# EAGLE design progUSB (EAGLE 5.10)
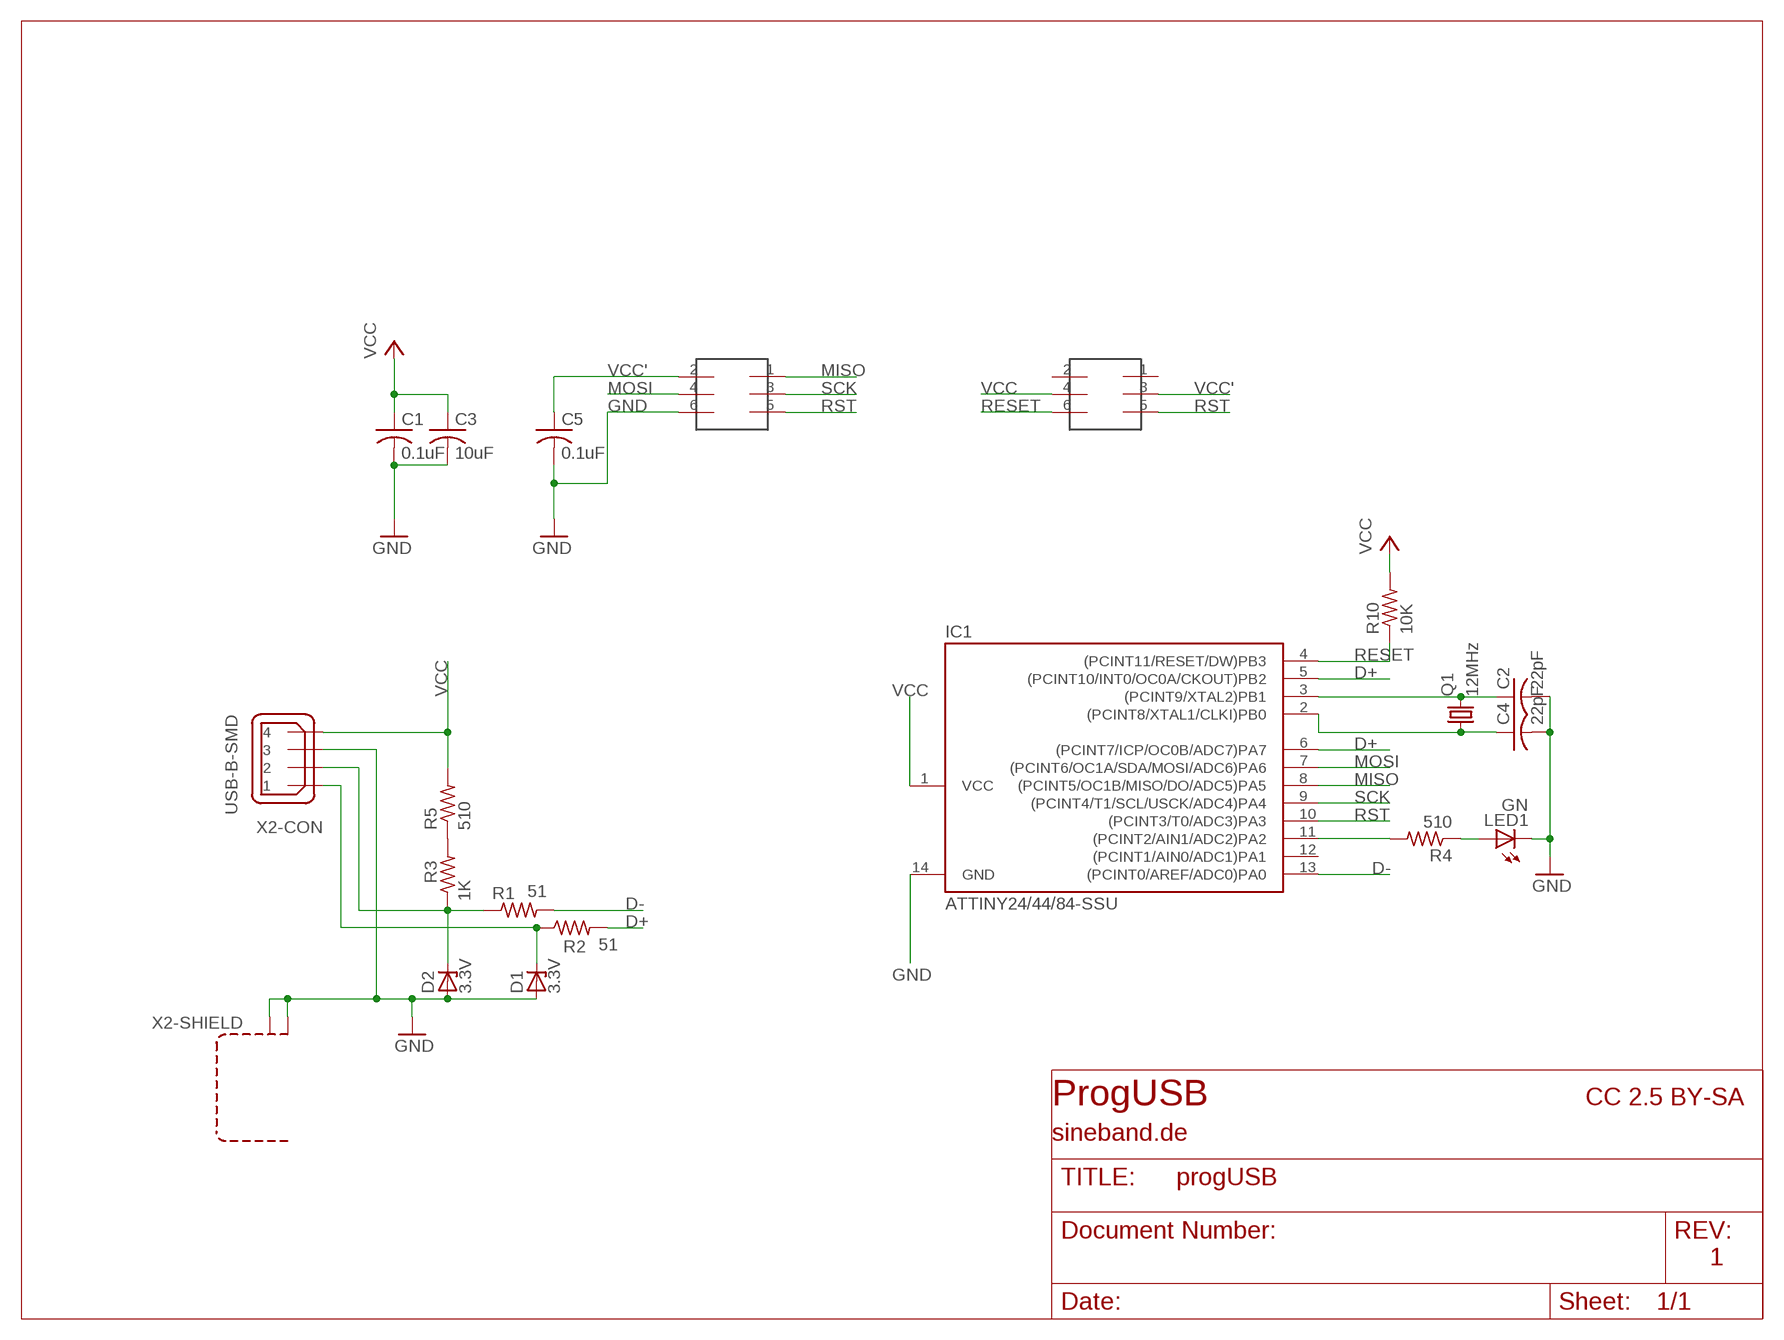
[diagram p0: schematic, sheet 1]

## Parts
C1  0.1uF  C-USC1206  [C1206]
C2  22pF  C-USC1206  [C1206]
C3  10uF  C-USC1206  [C1206]
C4  22pF  C-USC1206  [C1206]
C5  0.1uF  C-USC1206  [C1206]
D1  3.3V  ZENER-DIODESOT23  [SOT23]
D2  3.3V  ZENER-DIODESOT23  [SOT23]
IC1  ATTINY24/44/84-SSU  [SOIC14]
LED1  GN  LEDCHIPLED_0805  [CHIPLED_0805]
Q1  12MHz  CRYSTALHC49UP  [HC49UP]
R1  51  R-US_R1206  [R1206]
R2  51  R-US_R1206  [R1206]
R3  1K  R-US_R1206  [R1206]
R4  510  R-US_R1206  [R1206]
R5  510  R-US_R1206  [R1206]
R10  10K  R-US_R1206  [R1206]
U$1  2X3HEADER  [2X3_SMD]
U$2  2X3HEADER  [2X3_SMD]
X2  USB-B-SMD  [USB-B-SMD]

## Nets
D+: IC1.5((PCINT10/INT0/OC0A/CKOUT)PB2) IC1.6((PCINT7/ICP/OC0B/ADC7)PA7) R2.2
D-: IC1.13((PCINT0/AREF/ADC0)PA0) R1.2
GND: C1.2 C2.2 C3.2 C4.2 C5.2 D1.1(A) D2.1(A) IC1.14(GND) LED1.C U$1.6 X2.3 X2.M1(-SHIELD:S1) X2.M2(-SHIELD:S2)
MISO: IC1.8((PCINT5/OC1B/MISO/DO/ADC5)PA5) U$1.1
MOSI: IC1.7((PCINT6/OC1A/SDA/MOSI/ADC6)PA6) U$1.4
N$1: D2.3(C) R1.1 R3.1 X2.2
N$2: D1.3(C) R2.1 X2.1
N$3: LED1.A R4.1
N$4: C4.1 IC1.2((PCINT8/XTAL1/CLKI)PB0) Q1.1
N$5: C2.1 IC1.3((PCINT9/XTAL2)PB1) Q1.2
N$6: R3.2 R5.1
N$7: IC1.11((PCINT2/AIN1/ADC2)PA2) R4.2
RESET: IC1.4((PCINT11/RESET/DW)PB3) R10.1 U$2.6
RST: IC1.10((PCINT3/T0/ADC3)PA3) U$1.5 U$2.5
SCK: IC1.9((PCINT4/T1/SCL/USCK/ADC4)PA4) U$1.3
VCC: C1.1 C3.1 IC1.1(VCC) R5.2 R10.2 U$2.4 X2.4
VCC': C5.1 U$1.2 U$2.3
Unconnected: IC1.12((PCINT1/AIN0/ADC1)PA1) U$2.1 U$2.2

## Notes on the sheet
- ProgUSB | CC 2.5 BY-SA
- sineband.de
- 1

## Library data of the parts
C1 C5 = rcl-ez:C-US: CAPACITOR, American symbol
C2-C4 = rcl:C-US: CAPACITOR, American symbol
D1 D2 = diode:ZENER-DIODE: Z-Diode
IC1 = attiny24_44_84:ATTINY24/44/84
LED1 = led:LED: LED OSRAM: - CHIPLED LG R971, LG N971, LY N971, LG Q971, LY Q971, LO R971, LY R971 LH N974, LH R974 LS Q976, LO Q976, LY Q976 LO Q996 - Hyper CHIPLED LW Q18S LB Q993, LB Q99A, LB R99A - SideLED LS A670, LO A670, LY A670, LG A670, LP A670 LB A673, LV A673, LT A673, LW A673 LH A674 LY A675 LS A676, LA A676, LO A676, LY A676, LW A676 LS A679, LY A679, LG A679 - Hyper Micro SIDELED® LS Y876, LA Y876, LO Y876, LY Y876 LT Y87S - SmartLED LW L88C, LW L88S LB L89C, LB L89S, LG L890 LS L89K, LO L89K, LY L89K LS L896, LA L896, LO L896, LY L896 - TOPLED LS T670, LO T670, LY T670, LG T670, LP T670 LSG T670, LSP T670, LSY T670, LOP T670, LYG T670 LG T671, LOG T671, LSG T671 LB T673, LV T673, LT T673, LW T673 LH T674 LS T676, LA T676, LO T676, LY T676, LB T676, LH T676, LSB T676, LW T676 LB T67C, LV T67C, LT T67C, LS T67K, LO T67K, LY T67K, LW E67C LS E67B, LA E67B, LO E67B, LY E67B, LB E67C, LV E67C, LT E67C LW T67C LS T679, LY T679, LG T679 LS T770, LO T770, LY T770, LG T770, LP T770 LB T773, LV T773, LT T773, LW T773 LH T774 LS E675, LA E675, LY E675, LS T675 LS T776, LA T776, LO T776, LY T776, LB T776 LHGB T686 LT T68C, LB T68C - Hyper Mini TOPLED® LB M676 - Mini TOPLED Santana® LG M470 LS M47K, LO M47K, LY M47K Source: http://www.osram.convergy.de LUXEON: - LUMILED® LXK2-PW12-R00, LXK2-PW12-S00, LXK2-PW14-U00, LXK2-PW14-V00 LXK2-PM12-R00, LXK2-PM12-S00, LXK2-PM14-U00 LXK2-PE12-Q00, LXK2-PE12-R00, LXK2-PE12-S00, LXK2-PE14-T00, LXK2-PE14-U00 LXK2-PB12-K00, LXK2-PB12-L00, LXK2-PB12-M00, LXK2-PB14-N00, LXK2-PB14-P00, LXK2-PB14-Q00 LXK2-PR12-L00, LXK2-PR12-M00, LXK2-PR14-Q00, LXK2-PR14-R00 LXK2-PD12-Q00, LXK2-PD12-R00, LXK2-PD12-S00 LXK2-PH12-R00, LXK2-PH12-S00 LXK2-PL12-P00, LXK2-PL12-Q00, LXK2-PL12-R00 Source: www.luxeon.com KINGBRIGHT: KA-3528ASYC Source: www.kingbright.com
Q1 = crystal:CRYSTAL: CRYSTAL
R1-R3 R10 = rcl-ez:R-US_: RESISTOR, American symbol
R4 R5 = rcl:R-US_: RESISTOR, American symbol
U$1 U$2 = mellis:2X3HEADER
X2 = 1_USER:USB-B-SMD

## Net classes
0 default: width 0.2 mm, clearance 0.2 mm

## Board
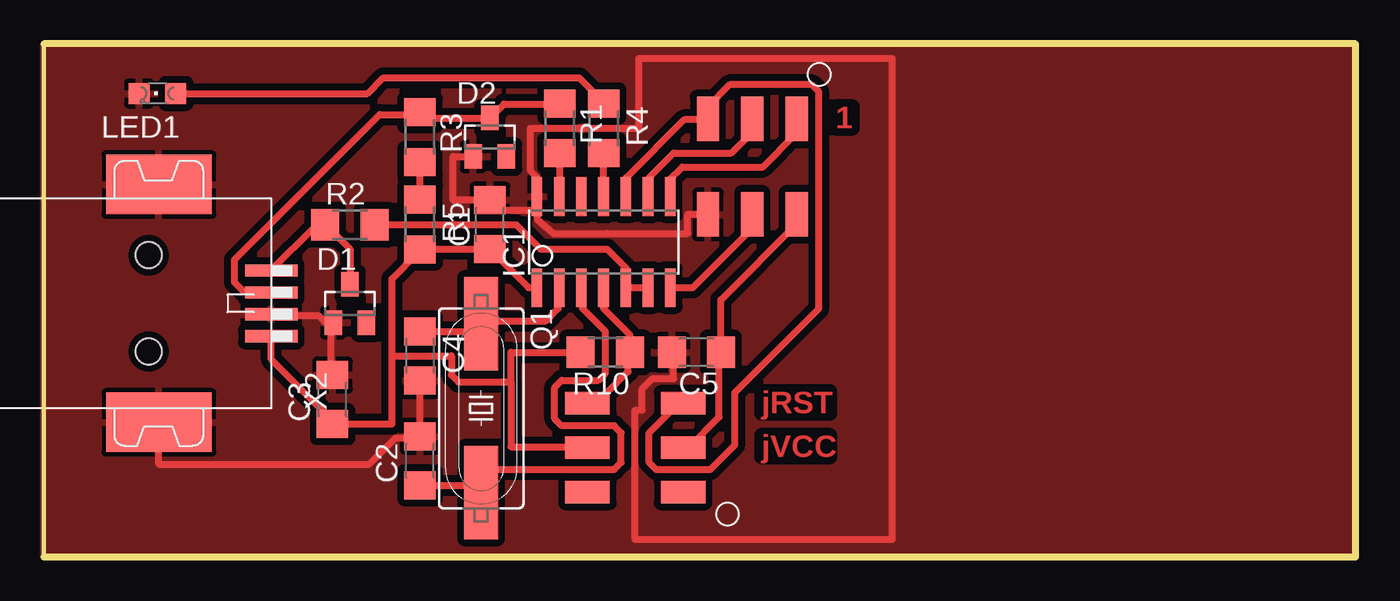
[diagram p1: board, top side]

Size 74.99 x 29.34 mm. Coordinates in mm from the lower left corner, seen from the top.
Outline: 0,0 74.99,0 74.99,29.34 0,29.34 0,0
Copper layers (1*16): Top 0.035mm / dielectric 1.5mm / Bottom 0.035mm
Design rules "default *": minimum track width 0.4mm, minimum drill 24mil, track to track 0.4mm, track to pad 0.4mm, pad to pad 8mil, via to via 8mil, smd to smd 8mil, copper to edge 0mil, drill to drill 8mil, minimum pad ring 10mil, minimum via ring 8mil, stop-mask expansion 4mil, vias tented up to drill 0mil, thermal gap 10mil

### Footprints (pad centres in the part's own frame; a part is rotated, then mirrored left to right if it is on the bottom)
C1206 = smd 1.6 x 1.8: 1 -1.4,0; 2 1.4,0
SOT23 = smd 1 x 1.4: 1 -0.95,-1.1; 2 0.95,-1.1; 3 0,1.1
SOIC14 = smd 0.61 x 2.21: 1 -3.81,-2.603; 2 -2.54,-2.603; 3 -1.27,-2.603; 4 0,-2.603; 5 1.27,-2.603; 6 2.54,-2.603; 7 3.81,-2.603; 8 3.81,2.603; 9 2.54,2.603; 10 1.27,2.603; 11 0,2.603; 12 -1.27,2.603; 13 -2.54,2.603; 14 -3.81,2.603
CHIPLED_0805 = smd 1.2 x 1.2: A 0,-1.05; C 0,1.05
HC49UP = smd 5.334 x 1.93: 1 -4.826,0; 2 4.826,0
R1206 = smd 1.6 x 1.803: 1 -1.422,0; 2 1.422,0
2X3_SMD = smd 2.54 x 1.27: 1 -2.54,2.54; 2 2.92,2.54; 3 -2.54,0; 4 2.92,0; 5 -2.54,-2.54; 6 2.92,-2.54
USB-B-SMD = smd 3 x 0.7: 1 7,1.875; 2 7,0.625; 3 7,-0.625; 4 7,-1.875 | smd 6.04 x 3.4: M1 0.58,-6.8; M2 0.58,6.8 | hole 1.5: 0,-2.75; 0,2.75

### Placement (x,y rotation side)
C1  25.5,19 90 top
C2  21.5,5.5 90 top
C3  16.5,9 90 top
C4  21.5,11.5 270 top
C5  37.3,11.7 180 top
D1  17.5,14.5 0 top
D2  25.5,24 0 top
IC1  32,18 0 top
LED1  6.5,26.5 90 top
Q1  25,8.5 270 top
R1  29.5,24.5 270 top
R2  17.5,19 0 top
R3  21.5,24 270 top
R4  32,24.5 270 top
R5  21.5,19 270 top
R10  32.1,11.7 180 top
U$1  40.5,22.5 270 top
U$2  34,6.25 180 top
X2  6,14.5 0 top

### Tracks (layer width: path | path; a pad name or v marks a point on that pad's centre or on a via)
D+
  Top 0.4: R2.2 27,19 28.4,17.6 32.2,17.6 33.3,16.5 33.3,15.4 IC1.5 | IC1.6 34.5,15.4
  Top 0.406: 33.3,15.4 IC1.6
D-
  Top 0.4: R1.2 29.5,20.7 IC1.13
GND
  Top 0.4: C4.2 C2.2 21.4,6.8 20.1,6.8 18.6,5.3 6.58,5.3 X2.M1 6.6,7.7 6.6,9 | D1.1 16.4,13.3 | C3.2 16.4,10.5 16.4,13.1 D1.1 | D2.1 23.4,22.9 23.4,20.4 C1.2 25.4,20.4 26,19.8 28.1,19.8 28.2,19.9 IC1.14 | 32.2,18.5 29.1,18.5 28.2,19.3 28.2,19.7 IC1.14 | 37.9,18.5 38,18.6 38,19.5 U$1.6 | 5.6,26.4 LED1.C 5.4,26.6 | X2.3 13,13.8 15.7,13.8 16.2,13.3 D1.1 | C5.2 36,11.7 36,10.2 34.8,10.2 34.2,9.6 34.2,8.4 33.8,8.4 33.8,1 48.5,1 48.5,28.5 34,28.5 34,24.5 27.8,24.5 27.8,22.1 28.2,21.7 28.2,21.5 28.19,21.5 IC1.14
  Top 0.406: LED1.C 5.5,26.5 | 32.2,18.5 36.8,18.5 36.8,19.6 37.9,19.6 | 37.9,19.6 38,19.6 | 37.9,19.6 37.9,18.5
  pour Top (isolate 0.4): 0,0 0,29.34 74.93,29.34 74.93,0
MISO
  Top 0.4: IC1.8 35.9,20.7 35.8,21.6 36.5,22.3 41.1,22.3 43,24.2 43,25 U$1.1
MOSI
  Top 0.4: IC1.7 35.9,15.4 37.1,15.4 40.5,18.8 U$1.4
N$1
  Top 0.4: R1.1 29.5,25.9 26.3,25.9 D2.3 21.8,25.1 21.5,25.4 R3.1 21.4,25.3 19.2,25.3 10.9,17 10.9,15.7 11.4,15.2 13,15.2 X2.2 13,15.1
N$2
  Top 0.4: D1.3 17.5,17.6 16.1,19 R2.1 15.9,18.9 15.5,18.9 13,16.4 X2.1
N$3
  Top 0.4: LED1.A 18.5,26.5 19.4,27.4 30.6,27.4 32,26 R4.1
N$4
  Top 0.4: C4.1 24.6,12.9 25,13.3 Q1.1 25.1,13.5 28.7,13.5 29.4,14.2 29.4,15.3 IC1.2
N$5
  Top 0.4: C2.1 24.6,4.1 25,3.7 Q1.2 25.1,3.8 25.3,5 32.6,5 33,5.4 33,7.1 32.6,7.5 29.6,7.5 29.2,7.9 29.2,9.7 29.6,10.1 31.7,10.1 32.1,10.5 32.1,12.9 30.8,14.2 30.8,15.3 IC1.3
N$6
  Top 0.4: R5.1 R3.2
N$7
  Top 0.4: IC1.11 R4.2
RESET
  Top 0.4: R10.1 33.5,11.7 | U$2.6 31.1,8.8 31.6,8.8 33.4,10.6 33.4,11.6 R10.1 | IC1.4 32,14.2 33.5,12.7 33.5,11.9 R10.1
RST
  Top 0.4: IC1.10 33.3,20.7 33.3,21.7 36.6,25 37.9,25 U$1.5 37.9,25.7 39.2,27 43.9,27 44.3,26.6 44.3,14.2 39.5,9.4 39.5,6.4 38.1,5 35,5 34.6,5.4 34.6,7.1 36.2,8.7 36.5,8.7 U$2.5
SCK
  Top 0.4: IC1.9 34.6,20.7 34.6,21.7 36,23.1 39.3,23.1 40.5,24.3 U$1.3
VCC
  Top 0.4: IC1.1 28.1,15.4 27.7,15.4 C1.1 21.5,17.6 R5.2 21.4,17.4 19.9,15.9 19.9,11.5 | X2.4 13,11.3 16.4,7.9 16.4,7.7 C3.1 19.9,7.6 19.9,11.5 | 19.9,11.5 23.3,11.5 23.3,10.4 23.7,10 26.7,10 26.7,6.3 31,6.3 U$2.4 | 26.7,10.1 26.7,11.7 R10.2
  Top 0.406: 26.7,10 26.7,10.1
VCC'
  Top 0.4: 43.4,19.2 43.1,19.5 U$1.2 43.2,19.2 38.7,14.7 C5.1 38.6,11.6 38.6,8 36.9,6.3 36.6,6.3 U$2.3

### Text on the board
Top: 1 | jRST | jVCC